# EAGLE design ublox-lea6-test (EAGLE 7.1.0)
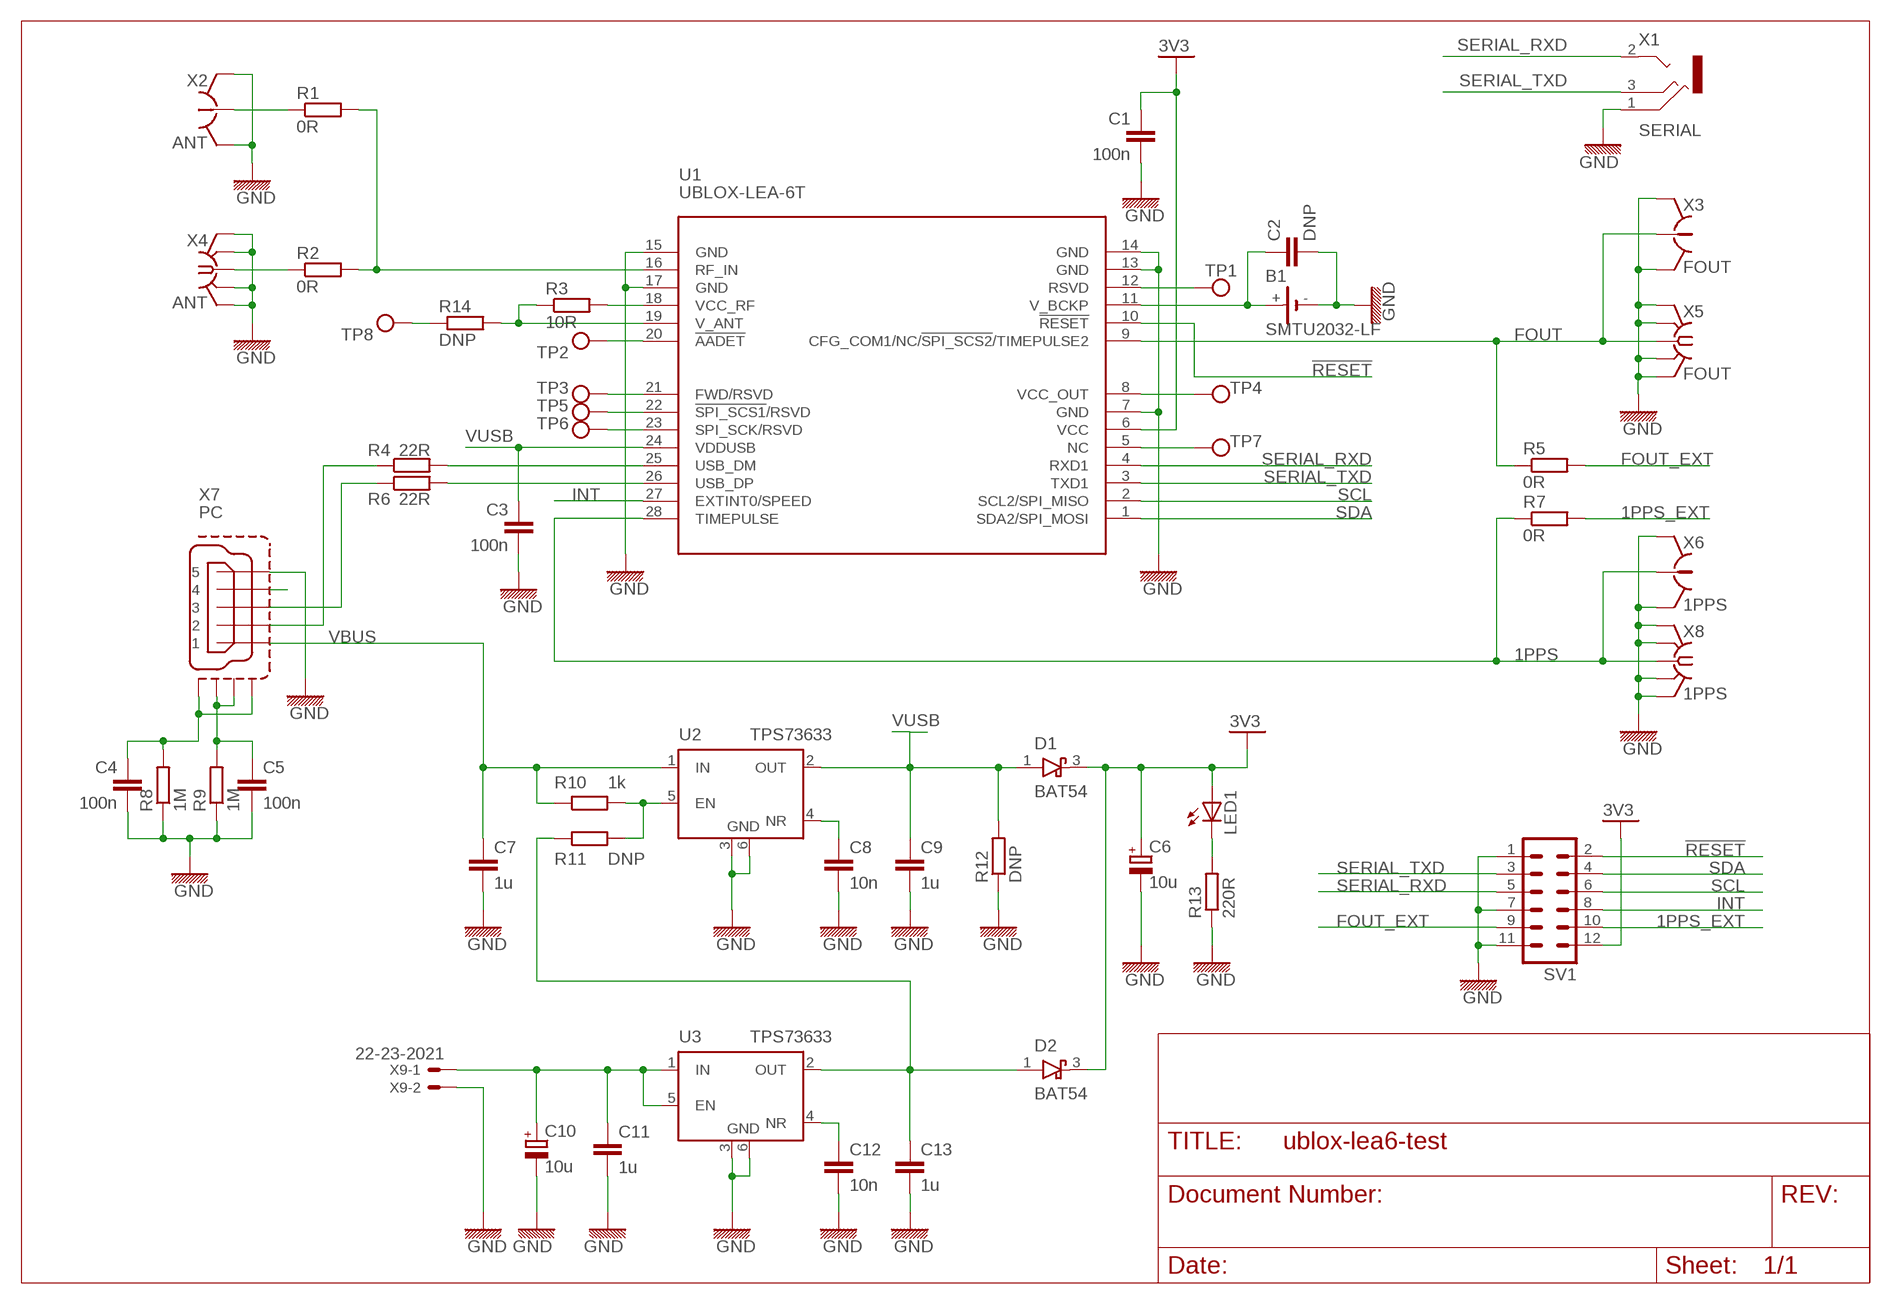
[diagram p0: schematic, sheet 1]

## Parts
B1  SMTU2032-LF  BA2032SMD  [SMTU2032]
C1  100n  C-EU_0603  [0603]
C2  DNP  C-EU_0603  [0603]
C3  100n  C-EU_0603  [0603]
C4  100n  C-EU_0603  [0603]
C5  100n  C-EU_0603  [0603]
C6  10u  CPOL-EUA/3216-18R  [A/3216-18R]
C7  1u  C-EU_0603  [0603]
C8  10n  C-EU_0603  [0603]
C9  1u  C-EU_0603  [0603]
C10  10u  CPOL-EUA/3216-18R  [A/3216-18R]
C11  1u  C-EU_0603  [0603]
C12  10n  C-EU_0603  [0603]
C13  1u  C-EU_0603  [0603]
D1  BAT54  D_SCHOTTKY_SOT23  [SOT23]
D2  BAT54  D_SCHOTTKY_SOT23  [SOT23]
LED1  LEDSML0603  [SML0603]
R1  0R  R-EU_0603  [0603]
R2  0R  R-EU_0603  [0603]
R3  10R  R-EU_0603  [0603]
R4  22R  R-EU_0603  [0603]
R5  0R  R-EU_0603  [0603]
R6  22R  R-EU_0603  [0603]
R7  0R  R-EU_0603  [0603]
R8  1M  R-EU_0603  [0603]
R9  1M  R-EU_0603  [0603]
R10  1k  R-EU_0603  [0603]
R11  DNP  R-EU_0603  [0603]
R12  DNP  R-EU_0603  [0603]
R13  220R  R-EU_0603  [0603]
R14  DNP  R-EU_0603  [0603]
SV1  MA06-2  [MA06-2]
TP1  TESTPAD  [TP_1X1]
TP2  TESTPAD  [TP_1X1]
TP3  TESTPAD  [TP_1X1]
TP4  TESTPAD  [TP_1X1]
TP5  TESTPAD  [TP_1X1]
TP6  TESTPAD  [TP_1X1]
TP7  TESTPAD  [TP_1X1]
TP8  TESTPAD  [TP_1X1]
U1  UBLOX-LEA-6T  [UBLOX-LEA-6]
U2  TPS73633  TPS736XX  [SOT223-6]
U3  TPS73633  TPS736XX  [SOT223-6]
X1  SERIAL  JACK2.5_SJ-2523  [JACK2.5_SJ-2523]
X2  ANT  HRS_UFL  [HRS_UFL]
X3  FOUT  HRS_UFL  [HRS_UFL]
X4  ANT  SMA-F-S-EDGE  [SMA-F-S-EDGE]
X5  FOUT  SMA-F-S-EDGE  [SMA-F-S-EDGE]
X6  1PPS  HRS_UFL  [HRS_UFL]
X7  PC  MINI-USB-SHIELD-UX60-MB-5ST  [UX60-MB-5ST]
X8  1PPS  SMA-F-S-EDGE  [SMA-F-S-EDGE]
X9  22-23-2021  [22-23-2021]

## Nets
1PPS: R7.1 U1.28(TIMEPULSE) X6.SIG X8.C
1PPS_EXT: R7.2 SV1.10
3V3: C1.1 C6.+ D1.3(C) D2.3(C) LED1.A SV1.12 U1.6(VCC)
!RESET: SV1.2 U1.10(!RESET)
FOUT: R5.1 U1.9(CFG_COM1/NC/!SPI_SCS2!/TIMEPULSE2) X3.SIG X5.C
FOUT_EXT: R5.2 SV1.9
GND: B1.- C1.2 C2.2 C3.2 C4.2 C5.2 C6.- C7.2 C8.2 C9.2 C10.- C11.2 C12.2 C13.2 R8.1 R9.1 R12.1 R13.1 SV1.1 SV1.7 SV1.11 U1.7(GND) U1.13(GND) U1.14(GND) U1.15(GND) U1.17(GND) U2.3(GND) U2.6(GND1) U3.3(GND) U3.6(GND1) X1.1(RING) X2.GND@1(GND) X2.GND@2(GND) X3.GND@1(GND) X3.GND@2(GND) X4.BG1(GND) X4.BG2(GND) X4.TG1(GND) X4.TG2(GND) X5.BG1(GND) X5.BG2(GND) X5.TG1(GND) X5.TG2(GND) X6.GND@1(GND) X6.GND@2(GND) X7.5 X8.BG1(GND) X8.BG2(GND) X8.TG1(GND) X8.TG2(GND) X9.2
INT: SV1.8 U1.27(EXTINT0/SPEED)
N$1: R2.1 X4.C
N$2: C4.1 R8.2 X7.M1(S1) X7.M4(S4)
N$3: R4.2 U1.25(USB_DM)
N$4: R6.2 U1.26(USB_DP)
N$5: R3.2 U1.18(VCC_RF)
N$6: R3.1 R14.2 U1.19(V_ANT)
N$7: TP3.TP U1.21(FWD/RSVD)
N$8: TP2.TP U1.20(!AADET)
N$10: TP5.TP U1.22(!SPI_SCS1!/RSVD)
N$11: TP6.TP U1.23(SPI_SCK/RSVD)
N$12: X7.4
N$13: R6.1 X7.3
N$14: R4.1 X7.2
N$15: C8.1 U2.4(NR)
N$16: TP1.TP U1.12(RSVD)
N$17: B1.+ C2.1 U1.11(V_BCKP)
N$18: R1.1 X2.SIG
N$19: TP4.TP U1.8(VCC_OUT)
N$20: TP7.TP U1.5(NC)
N$21: R1.2 R2.2 U1.16(RF_IN)
N$22: C5.1 R9.2 X7.M2(S2) X7.M3(S3)
N$23: C10.+ C11.1 U3.1(IN) U3.5(EN) X9.1
N$24: C12.1 U3.4(NR)
N$25: C13.1 D2.1(A) R11.1 U3.2(OUT)
N$26: R10.2 R11.2 U2.5(EN)
N$27: LED1.C R13.2
N$28: R14.1 TP8.TP
SCL: SV1.6 U1.2(SCL2/SPI_MISO)
SDA: SV1.4 U1.1(SDA2/SPI_MOSI)
SERIAL_RXD: SV1.5 U1.4(RXD1) X1.2(TIP)
SERIAL_TXD: SV1.3 U1.3(TXD1) X1.3(MIDDLE)
VBUS: C7.1 R10.1 U2.1(IN) X7.1
VUSB: C3.1 C9.1 D1.1(A) R12.2 U1.24(VDDUSB) U2.2(OUT)

## Library data of the parts
B1 = we_misc:BA2032: Generic battery / coin cell
C1-C5 C7-C9 C11-C13 = we_passive:C-EU: Capacitor
C6 C10 = rcl:CPOL-EU: POLARIZED CAPACITOR, European symbol
D1 D2 = we_passive:D_SCHOTTKY: Diode Schottky
LED1 = led:LED: LED OSRAM: - CHIPLED LG R971, LG N971, LY N971, LG Q971, LY Q971, LO R971, LY R971 LH N974, LH R974 LS Q976, LO Q976, LY Q976 LO Q996 - Hyper CHIPLED LW Q18S LB Q993, LB Q99A, LB R99A - SideLED LS A670, LO A670, LY A670, LG A670, LP A670 LB A673, LV A673, LT A673, LW A673 LH A674 LY A675 LS A676, LA A676, LO A676, LY A676, LW A676 LS A679, LY A679, LG A679 - Hyper Micro SIDELED® LS Y876, LA Y876, LO Y876, LY Y876 LT Y87S - SmartLED LW L88C, LW L88S LB L89C, LB L89S, LG L890 LS L89K, LO L89K, LY L89K LS L896, LA L896, LO L896, LY L896 - TOPLED LS T670, LO T670, LY T670, LG T670, LP T670 LSG T670, LSP T670, LSY T670, LOP T670, LYG T670 LG T671, LOG T671, LSG T671 LB T673, LV T673, LT T673, LW T673 LH T674 LS T676, LA T676, LO T676, LY T676, LB T676, LH T676, LSB T676, LW T676 LB T67C, LV T67C, LT T67C, LS T67K, LO T67K, LY T67K, LW E67C LS E67B, LA E67B, LO E67B, LY E67B, LB E67C, LV E67C, LT E67C LW T67C LS T679, LY T679, LG T679 LS T770, LO T770, LY T770, LG T770, LP T770 LB T773, LV T773, LT T773, LW T773 LH T774 LS E675, LA E675, LY E675, LS T675 LS T776, LA T776, LO T776, LY T776, LB T776 LHGB T686 LT T68C, LB T68C - Hyper Mini TOPLED® LB M676 - Mini TOPLED Santana® LG M470 LS M47K, LO M47K, LY M47K Source: http://www.osram.convergy.de LUXEON: - LUMILED® LXK2-PW12-R00, LXK2-PW12-S00, LXK2-PW14-U00, LXK2-PW14-V00 LXK2-PM12-R00, LXK2-PM12-S00, LXK2-PM14-U00 LXK2-PE12-Q00, LXK2-PE12-R00, LXK2-PE12-S00, LXK2-PE14-T00, LXK2-PE14-U00 LXK2-PB12-K00, LXK2-PB12-L00, LXK2-PB12-M00, LXK2-PB14-N00, LXK2-PB14-P00, LXK2-PB14-Q00 LXK2-PR12-L00, LXK2-PR12-M00, LXK2-PR14-Q00, LXK2-PR14-R00 LXK2-PD12-Q00, LXK2-PD12-R00, LXK2-PD12-S00 LXK2-PH12-R00, LXK2-PH12-S00 LXK2-PL12-P00, LXK2-PL12-Q00, LXK2-PL12-R00 Source: www.luxeon.com KINGBRIGHT: KA-3528ASYC Source: www.kingbright.com
R1-R14 = we_passive:R-EU: Resistor
SV1 = con-lstb-tnt:MA06-2: PIN HEADER; OC_FARNELL: unknown; OC_NEWARK: unknown
TP1-TP8 = we_conn:TESTPAD: Test Pad
U1 = we_chips:UBLOX-LEA-6: u-blox GPS modules LEA-6 line Various models LEA-6A, LEA-6S, LEA-6H, LEA-6T, LEA-6R See the datasheet for the various pin configuration depending on the model.
U2 U3 = laforge:TPS736XX: TI Cap-Free NMOS 400mA LDO
X1 = laforge:JACK2.5_SJ-2523: CUI Inc. SJ-2523-SMT
X2 X3 X6 = we_conn:HRS_UFL: Hirose U.FL SMT
X4 X5 X8 = we_conn:SMA-F
X7 = con-hirose:MINI-USB-SHIELD-: MINI USB Connector Source: http://www.hirose.co.jp/cataloge_hp/e24000019.pdf; OC_FARNELL: unknown; OC_NEWARK: unknown
X9 = con-molex:22-23-2021: .100" (2.54mm) Center Header - 2 Pin; MF: MOLEX; MPN: 22-23-2021; OC_FARNELL: 1462926; OC_NEWARK: 25C3832

## Board
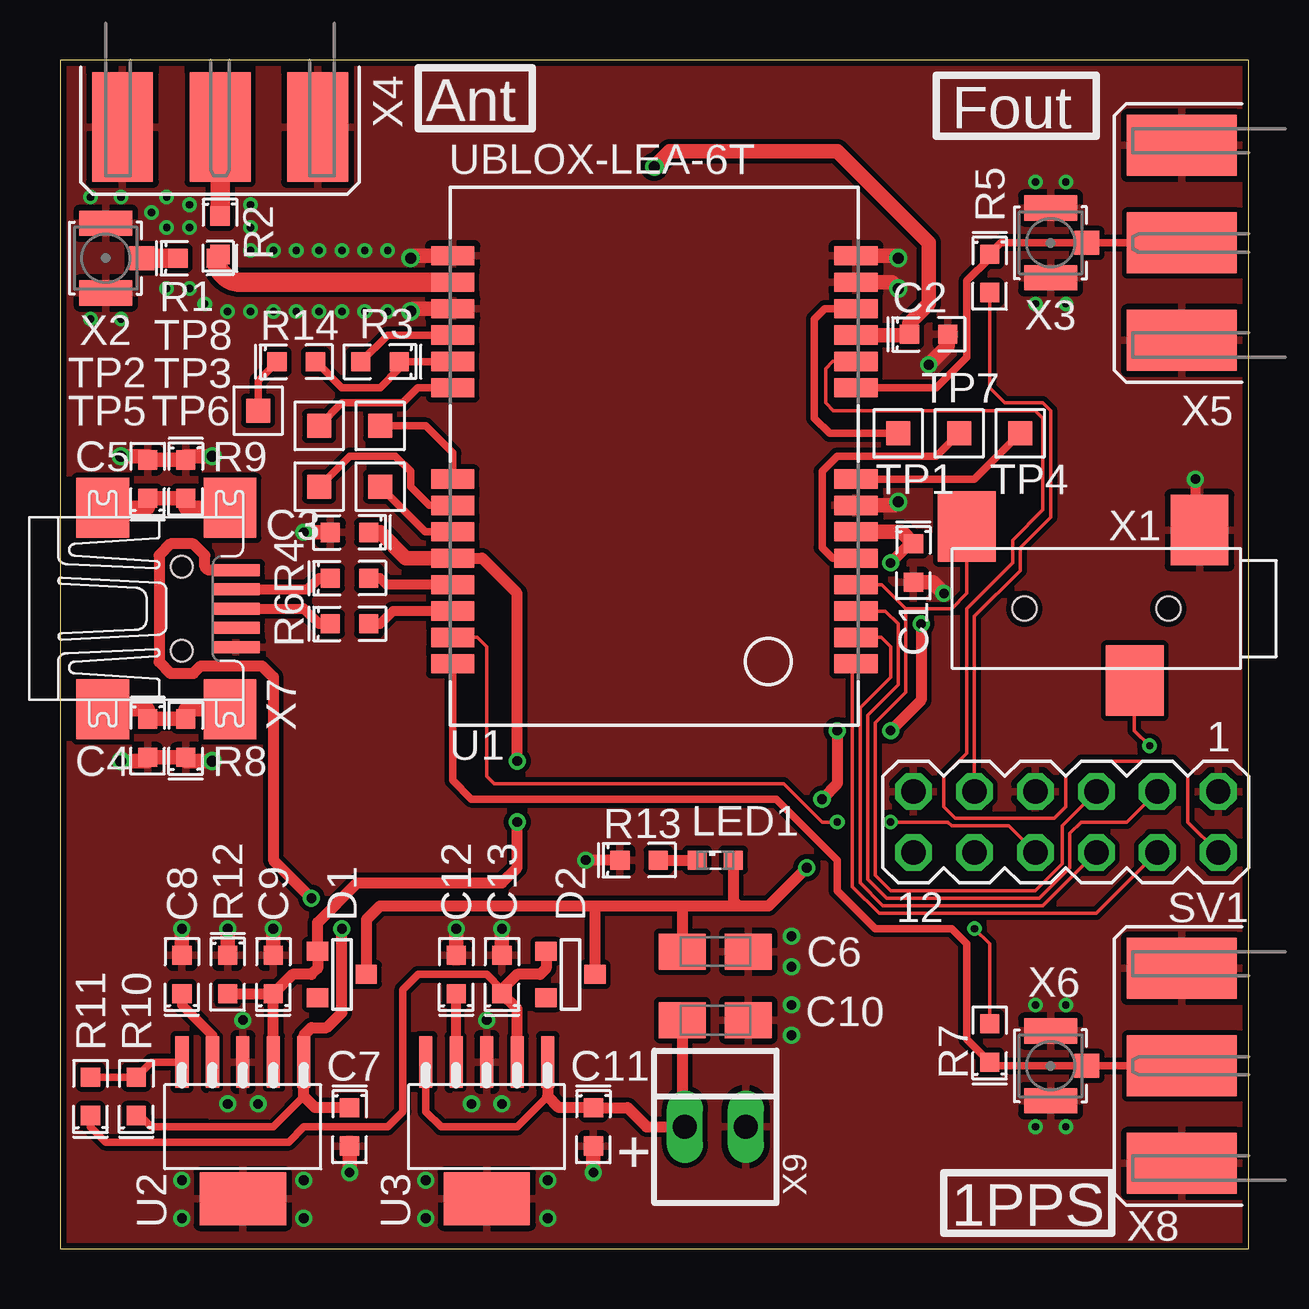
[diagram p1: board, top side]
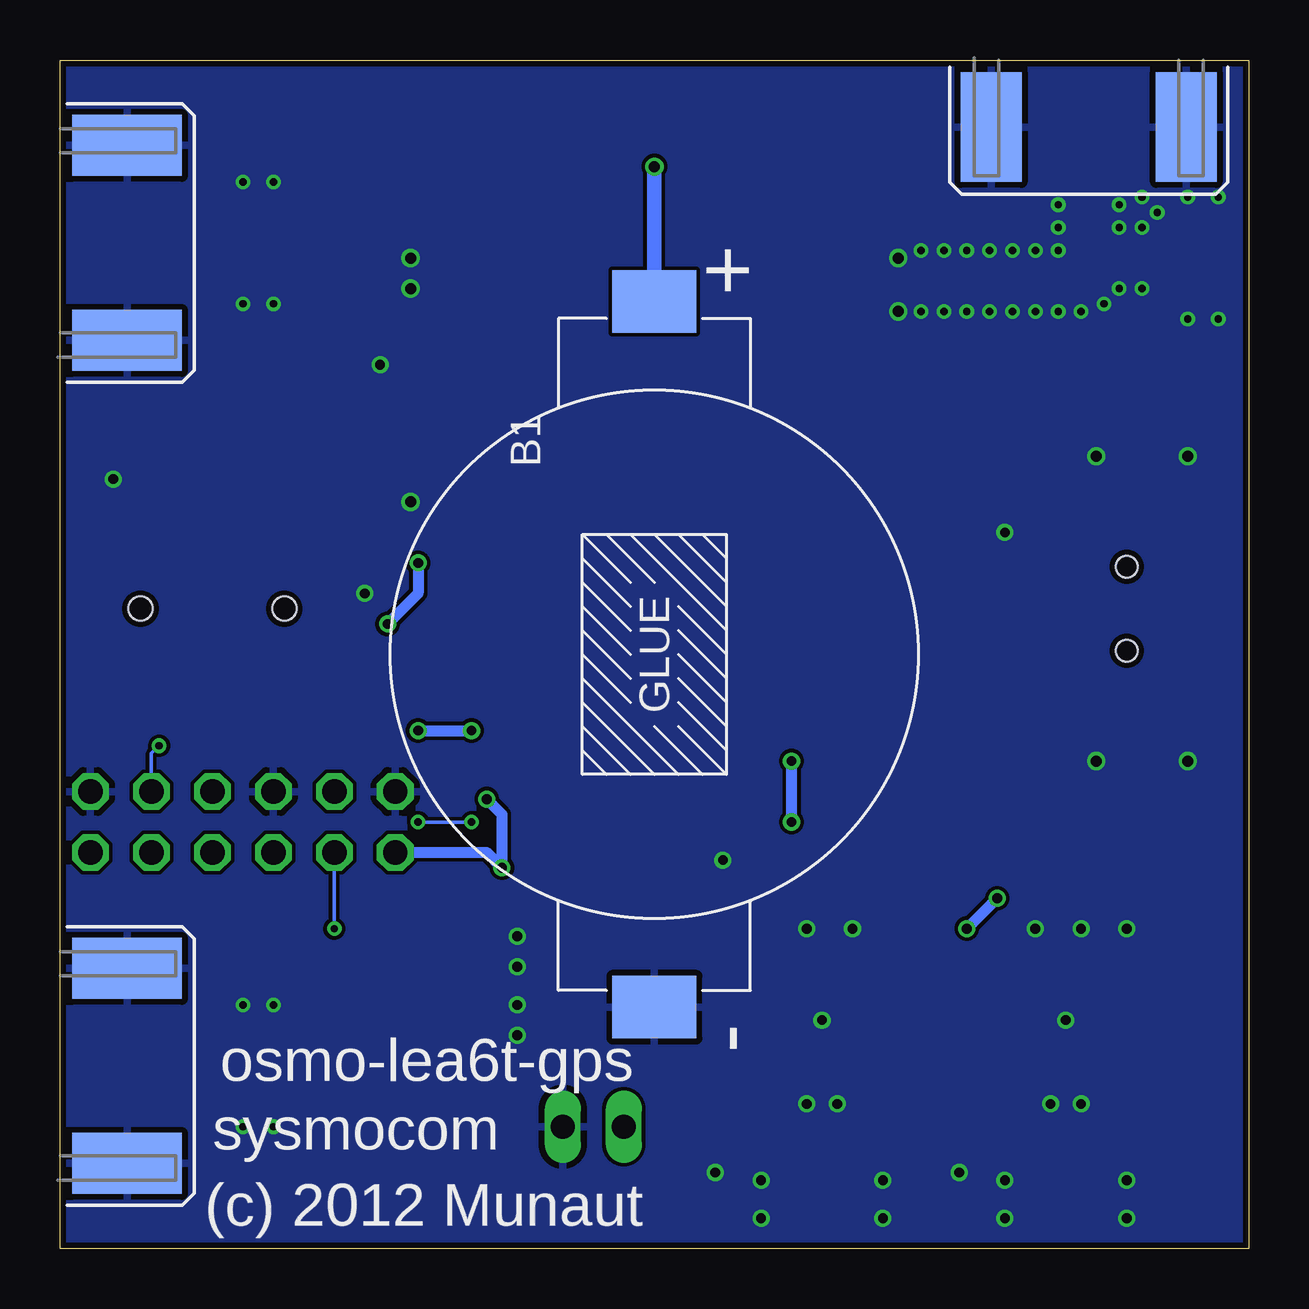
[diagram p2: board, bottom side, seen from below]

Size 49.53 x 49.53 mm. Coordinates in mm from the lower left corner, seen from the top.
Outline: 0,0 49.53,0 49.53,49.53 0,49.53 0,0
Copper layers (1*16): Top 0.035mm / dielectric 1.5mm / Bottom 0.035mm
Design rules "SeeedStudio_2layer_DRU_no_angle_20140221": minimum track width 6mil, minimum drill 12mil, track to track 6mil, track to pad 6mil, pad to pad 6mil, via to via 6mil, smd to smd 0mil, copper to edge 10mil, drill to drill 10mil, minimum pad ring 10mil, minimum via ring 6mil, stop-mask expansion 2mil, vias tented up to drill 100mil, thermal gap 10mil

### Footprints (pad centres in the part's own frame; a part is rotated, then mirrored left to right if it is on the bottom)
SMTU2032 = smd 2.6 x 3.5: + -14.7,0; - 14.7,0
0603 = smd 0.8 x 0.8: 1 -0.8,0; 2 0.8,0
A/3216-18R = smd 1.95 x 1.5: + 1.375,0; - -1.375,0
SOT23 = smd 0.787 x 0.889: 1 0.965,1.016; 2 -0.965,1.016; 3 0,-1.016
SML0603 = smd 0.8 x 0.8: A 0.75,0; C -0.75,0
MA06-2 = drill 1.016 octagon: 1 -6.35,-1.27; 2 -6.35,1.27; 3 -3.81,-1.27; 4 -3.81,1.27; 5 -1.27,-1.27; 6 -1.27,1.27; 7 1.27,-1.27; 8 1.27,1.27; 9 3.81,-1.27; 10 3.81,1.27; 11 6.35,-1.27; 12 6.35,1.27
TP_1X1 = smd 1 x 1: TP 0,0
UBLOX-LEA-6 = smd 1.8 x 0.8: 1 8.4,-8.65; 2 8.4,-7.55; 3 8.4,-6.45; 4 8.4,-5.35; 5 8.4,-4.25; 6 8.4,-3.15; 7 8.4,-2.05; 8 8.4,-0.95; 9 8.4,2.85; 10 8.4,3.95; 11 8.4,5.05; 12 8.4,6.15; 13 8.4,7.25; 14 8.4,8.35; 15 -8.4,8.35; 16 -8.4,7.25; 17 -8.4,6.15; 18 -8.4,5.05; 19 -8.4,3.95; 20 -8.4,2.85; 21 -8.4,-0.95; 22 -8.4,-2.05; 23 -8.4,-3.15; 24 -8.4,-4.25; 25 -8.4,-5.35; 26 -8.4,-6.45; 27 -8.4,-7.55; 28 -8.4,-8.65
SOT223-6 = smd 0.55 x 2.15: 1 -2.54,-2.7; 2 -1.27,-2.7; 3 0,-2.7; 4 1.27,-2.7; 5 2.54,-2.7 | smd 3.6 x 2.2: 6 0,3
JACK2.5_SJ-2523 = smd 2.4 x 2.94: 1 -4.3,-3.274; 2 5.4,-3.424; 3 -1.6,3 | hole 1: -3,0; 3,0
HRS_UFL = smd 1.05 x 2.2: GND@1 -1.452,0; GND@2 1.452,0 | smd 1 x 1.05: SIG 0,-1.502
SMA-F-S-EDGE = smd 4.572 x 2.54 bottom: BG1 2.794,-4.064; BG2 2.794,4.064 | smd 4.572 x 2.54: C 2.794,0; TG1 2.794,-4.064; TG2 2.794,4.064
UX60-MB-5ST = smd 2 x 0.5: 1 2.25,1.6; 2 2.25,0.8; 3 2.25,0; 4 2.25,-0.8; 5 2.25,-1.6 | smd 2.2 x 2.5: M1 -3.3,-4.2; M2 -3.3,4.2; M3 2,4.2; M4 2,-4.2 | hole 0.9: 0,-1.75; 0,1.75
22-23-2021 = drill 1 long: 1 -1.27,0; 2 1.27,0

### Placement (x,y rotation side)
B1  24.77,24.77 270 bottom
C1  35.56,28.57 270 top
C2  36.2,38.1 0 top
C3  12.06,29.84 180 top
C4  3.65,21.27 270 top
C5  3.65,32.07 90 top
C6  27.3,12.38 180 top
C7  12.06,5.08 270 top
C8  5.08,11.43 90 top
C9  8.89,11.43 90 top
C10  27.3,9.53 180 top
C11  22.23,5.08 270 top
C12  16.51,11.43 90 top
C13  18.41,11.43 90 top
D1  11.75,11.43 90 top
D2  21.27,11.43 90 top
LED1  27.3,16.19 0 top
R1  5.71,41.27 0 top
R2  6.67,42.23 270 top
R3  13.34,36.96 180 top
R4  12.06,27.94 0 top
R5  38.73,40.64 270 top
R6  12.06,26.04 0 top
R7  38.73,8.57 90 top
R8  5.24,21.27 90 top
R9  5.24,32.07 270 top
R10  3.17,6.35 90 top
R11  1.27,6.35 90 top
R12  6.99,11.43 270 top
R13  24.13,16.19 0 top
R14  9.84,36.96 0 top
SV1  41.91,17.78 180 top
TP1  34.92,33.97 0 top
TP2  10.79,34.29 0 top
TP3  13.34,34.29 0 top
TP4  40.01,33.97 0 top
TP5  10.79,31.75 0 top
TP6  13.34,31.75 0 top
TP7  37.47,33.97 0 top
TP8  8.26,34.92 0 top
U1  24.77,33.02 0 top
U2  7.62,5.08 180 top
U3  17.78,5.08 180 top
X1  43.18,26.67 180 top
X2  1.91,41.27 90 top
X3  41.27,41.91 90 top
X4  6.67,49.53 270 top
X5  49.53,41.91 180 top
X6  41.27,7.62 90 top
X7  5.08,26.67 0 top
X8  49.53,7.62 180 top
X9  27.3,5.08 0 top

### Tracks (layer width: path | path; a pad name or v marks a point on that pad's centre or on a via)
1PPS
  Top 0.305: X8.C X6.SIG 38.89,7.62 R7.1 37.78,8.72 37.78,12.7 37.15,13.34 33.97,13.34 32.38,14.92 32.38,16.19 29.84,18.73 17.14,18.73 16.36,19.51 U1.28
1PPS_EXT  (via drill 0.3)
  Top 0.152: R7.2 38.73,12.7 v38.1,13.34
  Bottom 0.152: v38.1,13.34 SV1.10
3V3  (via drill 0.41)
  Top 0.457: 22.23,14.29 13.34,14.29 12.76,13.72 D1.3 | 22.23,14.29 22.29,14.22 D2.3 | C1.1 35.41,29.38 v34.61,28.57 | v35.88,26.04 35.88,22.86 v34.61,21.59 | 22.23,14.29 26.04,14.29 | 26.04,14.29 28.26,14.29 | 28.26,14.29 29.53,14.29 v31.11,15.88 | 26.04,14.29 25.93,14.18 C6.+ | v32.38,21.59 32.38,19.37 v31.75,18.73 | LED1.A 28.05,14.49 28.26,14.29
  Top 0.61: U1.6 35.06,29.87 C1.1
  Bottom 0.457: SV1.12 31.75,16.51 v31.11,15.88 31.11,18.1 v31.75,18.73 | v34.61,28.57 34.61,27.3 v35.88,26.04 | v34.61,21.59 v32.38,21.59
!RESET
  Top 0.152: U1.10 32.21,36.97 31.91,36.67 31.91,35.24 32.23,34.92 40.64,34.92 40.96,34.61 40.96,30.8 39.69,29.53 39.69,28.57 37.78,26.67 37.78,20.64 36.83,19.68 36.83,18.41 37.31,17.94 41.43,17.94 41.91,18.41 41.91,19.68 42.55,20.32 46.35,20.32 46.99,19.68 46.99,17.78 SV1.2
FOUT
  Top 0.305: X5.C X3.SIG 39.2,41.91 R5.1 38.73,41.27 37.78,40.32 37.78,37.15 36.51,35.87 U1.9
FOUT_EXT
  Top 0.152: R5.2 38.73,35.88 39.37,35.24 40.96,35.24 41.27,34.92 41.27,30.48 40.01,29.21 40.01,28.26 38.1,26.35 SV1.9
GND  (via drill 0.3, 0.41, 0.46)
  Top 0.406: v47.31,32.07 47.31,30.12 X1.1
  Top 0.457: R13.1 v21.91,16.19
  Top 0.61: v6.35,20.32 5.24,20.32 R8.1 C4.2 3.65,20.32 v2.54,20.32 | v6.35,33.02 5.24,33.02 R9.1 C5.2 3.65,33.02 v2.54,33.02 | U1.13 34.66,40.27 v34.92,40.01 | U1.14 34.83,41.37 v34.92,41.27 | U1.7 34.78,30.97 v34.92,31.11 | U1.17 14.72,39.17 v14.61,39.05 | U1.15 14.7,41.37 v14.61,41.27 | C3.2 v10.16,29.84 | C2.2 36.99,37.63 v36.2,36.83 | C8.2 v5.08,13.34 | R12.1 v6.99,13.34 | C9.2 v8.89,13.34 | C7.2 v12.06,3.17 | C11.2 v22.23,3.17 | C12.2 v16.51,13.34 | C13.2 v18.41,13.34 | C1.2 36.36,27.77 v36.83,27.3
  other vias: 40.64,44.45 41.91,44.45 40.64,39.37 41.91,39.37 2.54,43.81 1.27,43.81 1.27,38.73 2.54,38.73 40.64,5.08 41.91,5.08 40.64,10.16 41.91,10.16 7.62,9.53 6.99,6.03 8.26,6.03 17.14,6.03 18.41,6.03 17.78,9.53 5.08,2.86 5.08,1.27 10.16,2.86 10.16,1.27 15.24,2.86 15.24,1.27 20.32,2.86 20.32,1.27 30.48,13.02 30.48,11.75 30.48,10.16 30.48,8.89 13.65,41.59 12.7,41.59 11.75,41.59 10.79,41.59 9.84,41.59 8.89,41.59 7.94,41.59 7.94,42.55 7.94,43.5 5.4,43.5 5.4,42.55 4.45,42.55 3.81,43.18 4.45,43.81 13.65,39.05 12.7,39.05 11.75,39.05 10.79,39.05 9.84,39.05 8.89,39.05 7.94,39.05 6.99,39.05 6.03,39.37 5.4,40.01 4.45,40.01
  pour Bottom: 0.32,49.21 49.21,49.21 49.21,0.32 0.32,0.32
  pour Top (isolate 0.203): 0.32,49.21 0.32,0.32 49.21,0.32 49.21,49.21
  pour Top: 6.35,10.16 9.21,10.16 9.21,5.4 6.35,5.4
  pour Top: 16.83,9.84 19.05,9.84 19.05,5.71 16.51,5.71 16.51,9.84
INT  (via drill 0.3)
  Top 0.152: SV1.8 39.53,17.62 37.15,17.62 36.99,17.78 v34.61,17.78 | v32.38,17.78 31.75,17.78 30.16,19.37 18.1,19.37 17.78,19.68 17.78,25.08 17.39,25.47 U1.27
  Bottom 0.152: v34.61,17.78 v32.38,17.78
N$1
  Top 0.813: R2.1 X4.C
N$2
  Top 0.61: X7.M1 3.65,22.47 C4.1 R8.2 5.24,22.47 X7.M4
N$3
  Top 0.406: U1.25 13.61,27.67 13.34,27.94 R4.2
N$4
  Top 0.406: U1.26 13.87,26.57 13.34,26.04 R6.2
N$5
  Top 0.305: U1.18 13.65,38.07 R3.2
N$6
  Top 0.305: U1.19 16.35,36.96 R3.1 14.13,36.68 13.34,35.88 11.75,35.88 10.67,36.96 R14.2
N$7
  Top 0.305: U1.21 16.36,33.16 15.24,34.29 TP3.TP
N$8
  Top 0.305: TP2.TP 11.75,35.24 14.29,35.24 14.91,35.87 U1.20
N$10
  Top 0.305: TP5.TP 12.06,33.02 13.97,33.02 14.61,32.38 14.61,31.75 15.38,30.97 U1.22
N$11
  Top 0.305: U1.23 15.21,29.87 TP6.TP
N$13
  Top 0.406: X7.3 10.16,26.67 10.79,26.04 R6.1
N$14
  Top 0.406: X7.2 10.32,27.47 10.79,27.94 R4.1
N$15
  Top 0.406: C8.1 5.08,10.16 6.35,8.89 U2.4
N$16
  Top 0.305: U1.12 31.87,39.17 31.43,38.73 31.43,34.61 32.07,33.97 TP1.TP
N$17  (via drill 0.46)
  Top 0.61: v24.77,45.09 25.4,45.72 32.38,45.72 36.2,41.91 36.2,39.37 35.4,38.57 C2.1 35.37,38.07 U1.11
  Bottom 0.61: B1.+ v24.77,45.09
N$18
  Top 0.813: R1.1 X2.SIG
N$19
  Top 0.305: U1.8 38.1,32.07 TP4.TP
N$20
  Top 0.305: U1.5 32.19,28.77 31.75,29.21 31.75,32.38 32.38,33.02 36.51,33.02 TP7.TP
N$21
  Top 0.61: R2.2 arc-90 R1.2
  Top 0.813: U1.16 7.52,40.27 arc-90 R1.2
N$22
  Top 0.61: X7.M2 3.65,30.87 C5.1 R9.2 5.24,30.87 X7.M3
N$23
  Top 0.305: U3.5 15.24,5.71 15.88,5.08 19.05,5.08 20.32,6.35
  Top 0.457: U3.1 20.32,6.35 20.79,5.88 C11.1 23.65,5.88 24.45,5.08 X9.1 25.93,5.18 C10.+
N$24
  Top 0.406: U3.4 C12.1
N$25
  Top 0.305: R11.1 1.27,5.08 1.91,4.45 9.53,4.45 10.16,5.08 13.65,5.08 14.29,5.71 14.29,10.79 14.92,11.43 17.78,11.43 18.41,10.79
  Top 0.457: U3.2 19.05,9.99 C13.1 18.41,10.79 19.05,11.43 20,11.43 20.26,11.68 D2.1
N$26
  Top 0.305: U2.5 3.81,7.78 R10.2 R11.2
N$27
  Top 0.457: R13.2 LED1.C
N$28
  Top 0.305: TP8.TP 8.26,36.17 R14.1
SCL
  Top 0.152: U1.2 34.22,25.47 34.61,25.08 34.61,23.81 33.34,22.54 33.34,15.24 34.29,14.29 40.96,14.29 SV1.6
SDA
  Top 0.152: SV1.4 43.18,13.97 34.13,13.97 33.02,15.08 33.02,24.23 U1.1
SERIAL_RXD
  Top 0.152: X1.2 37.78,27.3 37.15,26.67 35.24,26.67 | U1.4 34.24,27.67 35.24,26.67 | 35.24,26.67 35.24,23.18 33.97,21.91 33.97,15.56 34.61,14.92 40.64,14.92 41.75,16.03 41.75,17.62 SV1.5
SERIAL_TXD  (via drill 0.3)
  Top 0.152: U1.3 34.39,26.57 34.92,26.04 34.92,23.5 33.66,22.23 33.66,15.4 34.45,14.61 40.8,14.61 42.07,15.88 42.07,17.3 42.55,17.78 44.45,17.78 SV1.3 | v45.4,20.95 44.77,21.59 44.77,22.86 44.78,22.87 X1.3
  Bottom 0.152: SV1.3 45.72,20.64 v45.4,20.95
VBUS  (via drill 0.41)
  Top 0.305: U2.1 10.16,7.62 | R10.1 3.34,5.55 3.81,5.08 8.89,5.08 10.16,6.35
  Top 0.457: C7.1 10.63,5.88 10.16,6.35 10.16,7.62 | X7.1 6.18,28.27 6.03,28.42 6.03,28.89 5.56,29.37 4.6,29.37 4.13,28.89 4.13,24.45 4.6,23.97 5.56,23.97 5.87,24.29 8.41,24.29 8.89,23.81 8.89,16.19 v10.48,14.61 | U2.1 10.16,8.89 10.48,9.21 11.11,9.21 11.75,9.84 v11.75,13.34
  Bottom 0.457: v11.75,13.34 v10.48,14.61
VUSB  (via drill 0.41)
  Top 0.457: U2.2 C9.1 | R12.2 C9.1 | C9.1 9.69,11.43 10.48,11.43 10.73,11.68 D1.1 10.73,13.59 12.38,15.24 18.41,15.24 19.05,15.88 v19.05,17.78 | v19.05,20.32 19.05,27.3 17.59,28.77 U1.24
  Top 0.61: C3.1 13.34,29.84 14.41,28.77 U1.24
  Bottom 0.457: v19.05,17.78 v19.05,20.32

### Text on the board
tPlace: Ant | Fout | + | 1PPS
bPlace: osmo-lea6t-gps | sysmocom | (c) 2012 Munaut